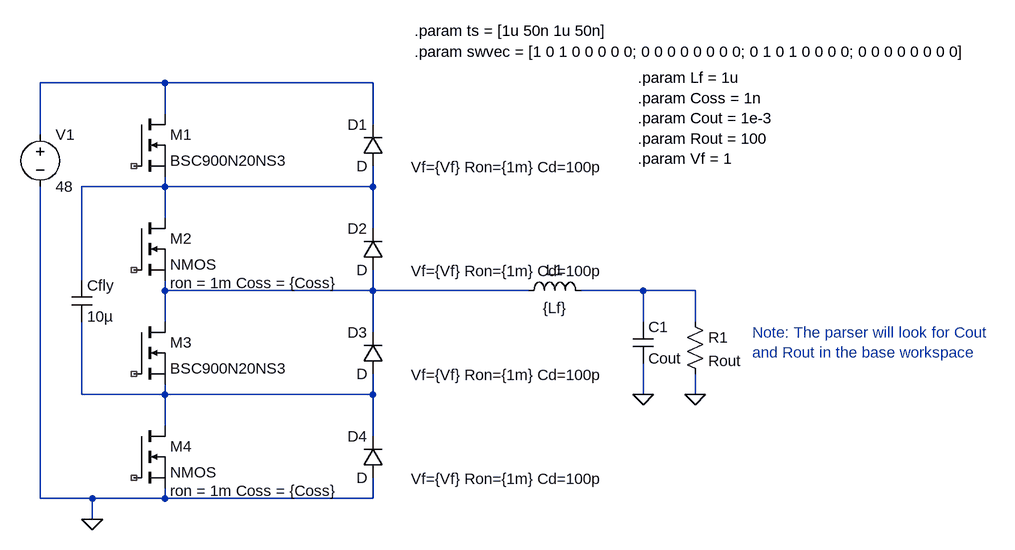
[diagram p0: schematic 3LevelBuckDep.asc]
3LevelBuckDep.asc, the LTspice schematic file:
Version 4
SHEET 1 1524 712
WIRE -32 16 -224 16
WIRE 288 16 -32 16
WIRE -32 64 -32 16
WIRE 288 80 288 16
WIRE -224 96 -224 16
WIRE -32 176 -32 160
WIRE -32 176 -160 176
WIRE 288 176 288 144
WIRE 288 176 -32 176
WIRE -32 224 -32 176
WIRE 288 240 288 176
WIRE -160 320 -160 176
WIRE -32 336 -32 320
WIRE 288 336 288 304
WIRE 288 336 -32 336
WIRE 528 336 288 336
WIRE 704 336 608 336
WIRE 784 336 704 336
WIRE -32 384 -32 336
WIRE 704 384 704 336
WIRE 784 384 784 336
WIRE 288 400 288 336
WIRE -160 496 -160 384
WIRE -32 496 -32 480
WIRE -32 496 -160 496
WIRE 288 496 288 464
WIRE 288 496 -32 496
WIRE 704 496 704 448
WIRE 784 496 784 464
WIRE -32 544 -32 496
WIRE 288 560 288 496
WIRE -224 656 -224 176
WIRE -144 656 -224 656
WIRE -32 656 -32 640
WIRE -32 656 -144 656
WIRE 288 656 288 624
WIRE 288 656 -32 656
WIRE -144 688 -144 656
FLAG -144 688 0
FLAG 704 496 0
FLAG 784 496 0
SYMBOL nmos -80 64 R0
SYMATTR InstName M1
SYMATTR Value BSC900N20NS3
SYMBOL nmos -80 224 R0
WINDOW 123 56 100 Left 2
SYMATTR Value2 ron = 1m Coss = {Coss}
SYMATTR InstName M2
SYMBOL voltage -224 80 R0
WINDOW 123 0 0 Left 0
WINDOW 39 0 0 Left 0
SYMATTR InstName V1
SYMATTR Value 48
SYMBOL ind 512 352 R270
WINDOW 0 32 56 VTop 2
WINDOW 3 5 56 VBottom 2
SYMATTR InstName L1
SYMATTR Value {Lf}
SYMBOL cap 688 384 R0
SYMATTR InstName C1
SYMATTR Value Cout
SYMBOL res 768 368 R0
SYMATTR InstName R1
SYMATTR Value Rout
SYMBOL nmos -80 384 R0
SYMATTR InstName M3
SYMATTR Value BSC900N20NS3
SYMBOL nmos -80 544 R0
WINDOW 123 56 100 Left 2
SYMATTR Value2 ron = 1m Coss = {Coss}
SYMATTR InstName M4
SYMBOL diode 304 144 R180
WINDOW 0 24 64 Left 2
WINDOW 3 24 0 Left 2
WINDOW 123 -340 -2 Left 2
SYMATTR InstName D1
SYMATTR Value2 Vf={Vf} Ron={1m} Cd=100p
SYMBOL diode 304 304 R180
WINDOW 0 24 64 Left 2
WINDOW 3 24 0 Left 2
WINDOW 123 -340 -2 Left 2
SYMATTR InstName D2
SYMATTR Value2 Vf={Vf} Ron={1m} Cd=100p
SYMBOL diode 304 464 R180
WINDOW 0 24 64 Left 2
WINDOW 3 24 0 Left 2
WINDOW 123 -340 -2 Left 2
SYMATTR InstName D3
SYMATTR Value2 Vf={Vf} Ron={1m} Cd=100p
SYMBOL diode 304 624 R180
WINDOW 0 24 64 Left 2
WINDOW 3 24 0 Left 2
WINDOW 123 -340 -2 Left 2
SYMATTR InstName D4
SYMATTR Value2 Vf={Vf} Ron={1m} Cd=100p
SYMBOL cap -176 320 R0
SYMATTR InstName Cfly
SYMATTR Value 10µ
TEXT 696 8 Left 2 !.param Lf = 1u\n.param Coss = 1n\n.param Cout = 1e-3\n.param Rout = 100\n.param Vf = 1
TEXT 352 -64 Left 2 !.param ts = [1u 50n 1u 50n]
TEXT 352 -32 Left 2 !.param swvec = [1 0 1 0 0 0 0 0; 0 0 0 0 0 0 0 0; 0 1 0 1 0 0 0 0; 0 0 0 0 0 0 0 0]
TEXT 872 400 Left 2 ;Note: The parser will look for Cout \nand Rout in the base workspace

The netlist it stands for:
* 3LevelBuckDep.asc
M1 N001 NC_01 N002 N002 BSC900N20NS3
M2 N002 NC_02 N003 N003 NMOS ron = 1m Coss = {Coss}
V1 N001 0 48
L1 N003 N004 {Lf}
C1 N004 0 Cout
R1 N004 0 Rout
M3 N003 NC_03 N005 N005 BSC900N20NS3
M4 N005 NC_04 0 0 NMOS ron = 1m Coss = {Coss}
D1 N002 N001 D Vf={Vf} Ron={1m} Cd=100p
D2 N003 N002 D Vf={Vf} Ron={1m} Cd=100p
D3 N005 N003 D Vf={Vf} Ron={1m} Cd=100p
D4 0 N005 D Vf={Vf} Ron={1m} Cd=100p
Cfly N002 N005 10µ
.model D D
.lib standard.dio
.model NMOS NMOS
.model PMOS PMOS
.lib standard.mos
.param Lf = 1u
.param Coss = 1n
.param Cout = 1e-3
.param Rout = 100
.param Vf = 1
.param ts = [1u 50n 1u 50n]
.param swvec = [1 0 1 0 0 0 0 0; 0 0 0 0 0 0 0 0; 0 1 0 1 0 0 0 0; 0 0 0 0 0 0 0 0]
* Note: The parser will look for Cout
* and Rout in the base workspace
.backanno
.end